# Altium schematic sheet clock.SchDoc: Temperature stable osc
size A4; Organization: Altium Limited; Address1: L3, 12a Rodborough Rd; Address2: Frenchs Forest; Address3: NSW; Address4: Australia 2086
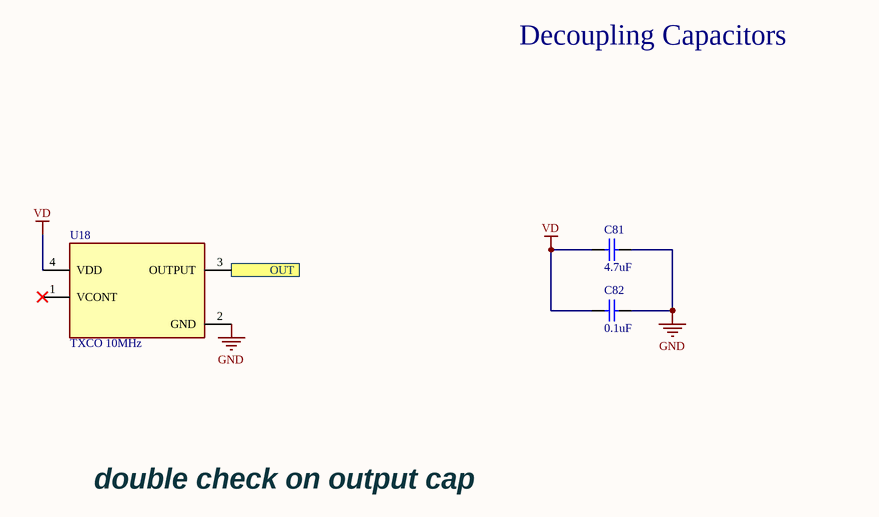
[diagram p0: clock.SchDoc]

## Parts
C81  4.7uF  [STD_0805_C]
C82  0.1uF  [STD_0805_C]
U18  TXCO 10MHz  [OSC_ECS-TXO-3225-100-TR]

## Ports
OUT (out)

## Nets
GND: C81.2 C82.2 U18.2(GND)
VD: C81.1 C82.1 U18.4(VDD)
OUT: U18.3(OUTPUT) ; port OUT

Not connected (* = marked no-connect by the designer): U18 1(VCONT)*

## Notes on the sheet
- Decoupling Capacitors
- double check on output cap
- Title
- Date:
- RE:
- Arturo di Girolamo
- Size:
- A3
- A

## Library data of the parts
C81 = CL21A475KAQNNNE: Capacitor, 4.7uF, 0805; Value: .01uf; MFGPN: CL21A475KAQNNNE
C82 = CL21B104KACNNNC: Capacitor, 0.1uF, 0805; Value: .01uf; MFGPN: CL21B104KACNNNC
U18 = ECS-TXO-3225-100-TR: 10 Mhz osc; MFGPN: ECS-TXO-3225-100-TR